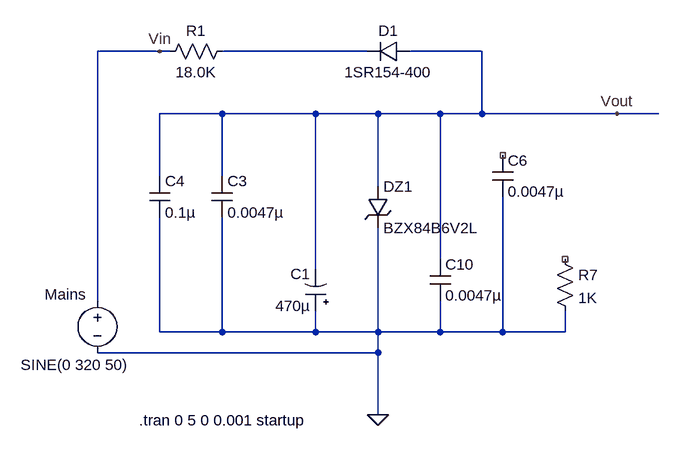
[diagram p0: schematic alimentation.asc]
alimentation.asc, the LTspice schematic file:
Version 4
SHEET 1 1224 1184
WIRE -240 464 -336 464
WIRE -224 464 -240 464
WIRE 80 464 -144 464
WIRE 256 464 144 464
WIRE -144 560 -240 560
WIRE 0 560 -144 560
WIRE 96 560 0 560
WIRE 192 560 96 560
WIRE 256 560 256 464
WIRE 256 560 192 560
WIRE 464 560 256 560
WIRE 528 560 464 560
WIRE -240 656 -240 560
WIRE -144 656 -144 560
WIRE 96 672 96 560
WIRE 192 784 192 560
WIRE 0 800 0 560
WIRE -336 848 -336 464
WIRE -240 896 -240 720
WIRE -144 896 -144 720
WIRE -144 896 -240 896
WIRE 0 896 0 864
WIRE 0 896 -144 896
WIRE 96 896 96 736
WIRE 96 896 0 896
WIRE 192 896 192 848
WIRE 192 896 96 896
WIRE 288 896 288 688
WIRE 288 896 192 896
WIRE 384 896 384 864
WIRE 384 896 288 896
WIRE 96 928 96 896
WIRE 96 928 -336 928
WIRE 96 1024 96 928
FLAG 96 1024 0
FLAG -240 464 Vin
FLAG 464 560 Vout
SYMBOL res -128 448 R90
WINDOW 0 0 56 VBottom 2
WINDOW 3 32 56 VTop 2
SYMATTR InstName R1
SYMATTR Value 18.0K
SYMATTR SpiceLine tol=5 pwr=3
SYMBOL res 368 768 R0
SYMATTR InstName R7
SYMATTR Value 1K
SYMATTR SpiceLine tol=1 pwr=0.1
SYMBOL cap 272 624 R0
SYMATTR InstName C6
SYMATTR Value 0.0047µ
SYMATTR SpiceLine V=250 Irms=0 Rser=0 Lser=0 mfg="Murata" pn="GCM31A5C2E472JX01" type="C0G"
SYMBOL cap 176 784 R0
SYMATTR InstName C10
SYMATTR Value 0.0047µ
SYMATTR SpiceLine V=250 Irms=0 Rser=0 Lser=0 mfg="Murata" pn="GCM31A5C2E472JX01" type="C0G"
SYMBOL cap -160 656 R0
SYMATTR InstName C3
SYMATTR Value 0.0047µ
SYMATTR SpiceLine V=250 Irms=0 Rser=0 Lser=0 mfg="Murata" pn="GCM31A5C2E472JX01" type="C0G"
SYMBOL polcap 16 864 R180
WINDOW 0 24 57 Left 2
WINDOW 3 24 8 Left 2
SYMATTR InstName C1
SYMATTR Value 470µ
SYMATTR Description Capacitor
SYMATTR Type cap
SYMATTR SpiceLine V=25 Irms=1.02 Rser=0.065 Lser=0 mfg="Nichicon" pn="UPL1E471MPH" type="Al electrolytic"
SYMBOL diode 144 448 R90
WINDOW 0 0 32 VBottom 2
WINDOW 3 32 32 VTop 2
SYMATTR InstName D1
SYMATTR Value 1SR154-400
SYMBOL zener 80 672 R0
SYMATTR InstName DZ1
SYMATTR Value BZX84B6V2L
SYMATTR Description Diode
SYMATTR Type diode
SYMBOL voltage -336 832 R0
WINDOW 123 24 124 Left 2
WINDOW 39 0 0 Left 0
WINDOW 3 -118 115 Left 2
WINDOW 0 -81 6 Left 2
SYMATTR Value SINE(0 320 50)
SYMATTR InstName Mains
SYMBOL cap -256 656 R0
SYMATTR InstName C4
SYMATTR Value 0.1µ
SYMATTR SpiceLine V=200 Irms=940m Rser=0.0607607 Lser=0 mfg="KEMET" pn="C1825C104K2RAC" type="X7R"
TEXT -272 1032 Left 2 !.tran 0 5 0 0.001 startup

The netlist it stands for:
* alimentation.asc
R1 N001 Vin 18.0K tol=5 pwr=3
R7 NC_01 0 1K tol=1 pwr=0.1
C6 NC_02 0 0.0047µ V=250 Irms=0 Rser=0 Lser=0 mfg="Murata" pn="GCM31A5C2E472JX01" type="C0G"
C10 Vout 0 0.0047µ V=250 Irms=0 Rser=0 Lser=0 mfg="Murata" pn="GCM31A5C2E472JX01" type="C0G"
C3 Vout 0 0.0047µ V=250 Irms=0 Rser=0 Lser=0 mfg="Murata" pn="GCM31A5C2E472JX01" type="C0G"
C1 0 Vout 470µ V=25 Irms=1.02 Rser=0.065 Lser=0 mfg="Nichicon" pn="UPL1E471MPH" type="Al electrolytic"
D1 Vout N001 1SR154-400
DZ1 Vout 0 BZX84B6V2L
V§Mains Vin 0 SINE(0 320 50)
C4 Vout 0 0.1µ V=200 Irms=940m Rser=0.0607607 Lser=0 mfg="KEMET" pn="C1825C104K2RAC" type="X7R"
.model D D
.lib standard.dio
.tran 0 5 0 0.001 startup
.backanno
.end